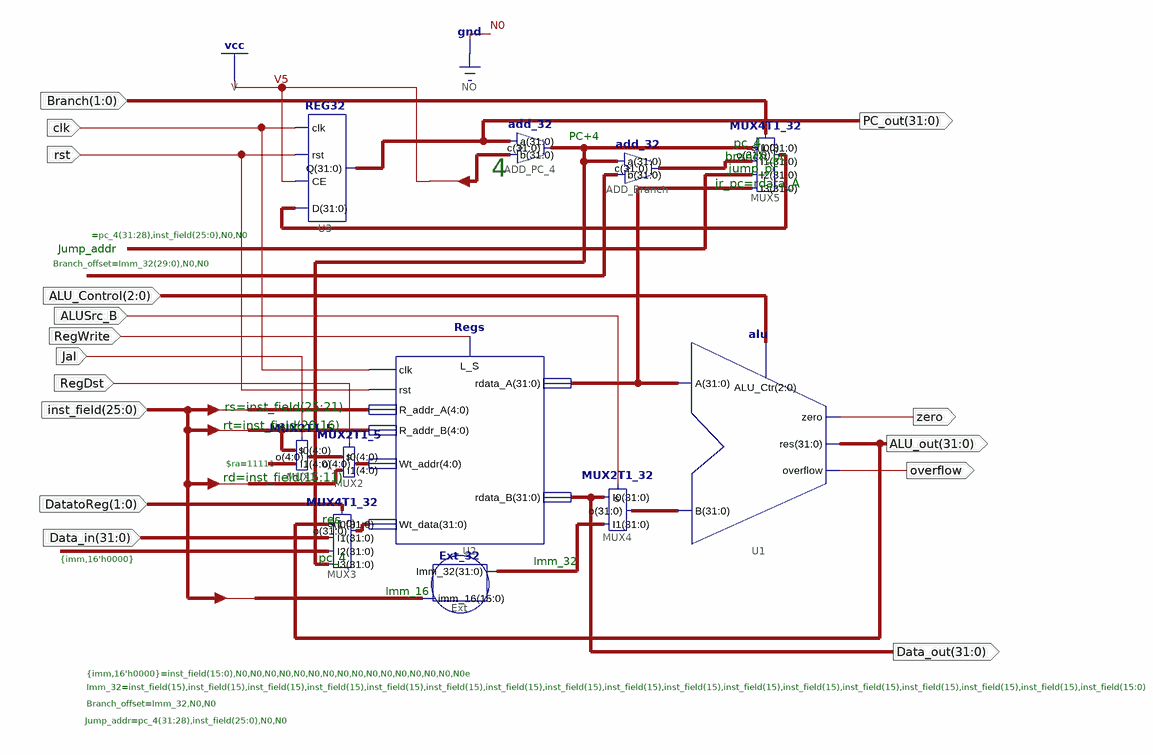
[diagram p0: schematic sheet 1]
// Xilinx ISE schematic SDPath_M.sch (kintex7) as structural Verilog: 11 symbols, 16 ports
module SDPath_M (
  input  ALUSrc_B,
  input  RegDst,
  input  rst,
  input  clk,
  input  [2:0] ALU_Control,
  input  [25:0] inst_field,
  input  RegWrite,
  input  Jal,
  input  [1:0] DatatoReg,
  input  [31:0] Data_in,
  input  [1:0] Branch,
  output [31:0] Data_out,
  output [31:0] PC_out,
  output zero,
  output [31:0] ALU_out,
  output overflow
);

  wire [4:0] XLXN_59, XLXN_616;
  wire [31:0] branch_addr, Imm_32, pc_4, XLXN_414, XLXN_530, XLXN_531, XLXN_577;

  Regs U2 (
    .clk(clk), .L_S(RegWrite), .rdata_A(XLXN_530), .rst(rst), .Wt_data(XLXN_414), .rdata_B(Data_out),
    .R_addr_A(inst_field[25:21]), .R_addr_B(inst_field[20:16]), .Wt_addr(XLXN_59));
  alu U1 (.ALU_Ctr(ALU_Control), .res(ALU_out), .zero(zero), .overflow(overflow), .A(XLXN_530), .B(XLXN_531));
  Ext_32 Ext (.imm_16(inst_field[15:0]), .Imm_32(Imm_32));
  add_32 ADD_Branch (.b({Imm_32[29:0], 2'b00}), .a(pc_4), .c(branch_addr));
  add_32 ADD_PC_4 (.b(32'b00000000000000000000000000000100), .a(PC_out), .c(pc_4));
  MUX4T1_32 MUX5 (
    .s(Branch), .I0(pc_4), .I1(branch_addr), .I2({pc_4[31:28], inst_field, 2'b00}), .I3(XLXN_530),
    .o(XLXN_577));
  REG32 U3 (.D(XLXN_577), .CE(1'b1), .rst(rst), .clk(clk), .Q(PC_out));
  MUX2T1_32 MUX4 (.s(ALUSrc_B), .I0(Data_out), .I1(Imm_32), .o(XLXN_531));
  MUX4T1_32 MUX3 (
    .s(DatatoReg), .I0(ALU_out), .I1(Data_in), .I2({inst_field[15:0], {16{1'b0}}}), .I3(pc_4), .o(XLXN_414));
  MUX2T1_5 MUX2 (.I1(inst_field[15:11]), .I0(XLXN_616), .o(XLXN_59), .s(RegDst));
  MUX2T1_5 MUX1 (.I1({5{1'b1}}), .I0(inst_field[20:16]), .o(XLXN_616), .s(Jal));

  // Notes on the sheet:
  //   PC+4
  //   pc_4
  //   branch_pc
  //   4
  //   jump_pc
  //   jr_pc=rdata_A
  //   =pc_4(31:28),inst_field(25:0),N0,N0
  //   Jump_addr
  //   Branch_offset=Imm_32(29:0),N0,N0
  //   rs=inst_field(25:21)
  //   rt=inst_field(20:16)
  //   $ra=11111
  //   rd=inst_field(15:11)
  //   res
  //   pc_4
  //   {imm,16'h0000}
  //   Imm_32
  //   Imm_16
  //   {imm,16'h0000}=inst_field(15:0),N0,N0,N0,N0,N0,N0,N0,N0,N0,N0,N0,N0,N0,N0,N0,N0e
  //   Imm_32=inst_field(15),inst_field(15),inst_field(15),inst_field(15),inst_field(15),inst_field(15),inst_field(15),inst_field(15),inst_field(15),inst_field(15),inst_field(15),inst_field(15),inst_field(15),inst_field(15),inst_field(15),inst_field(15),inst_field(15:0)
  //   Branch_offset=Imm_32,N0,N0
  //   Jump_addr=pc_4(31:28),inst_field(25:0),N0,N0
endmodule
